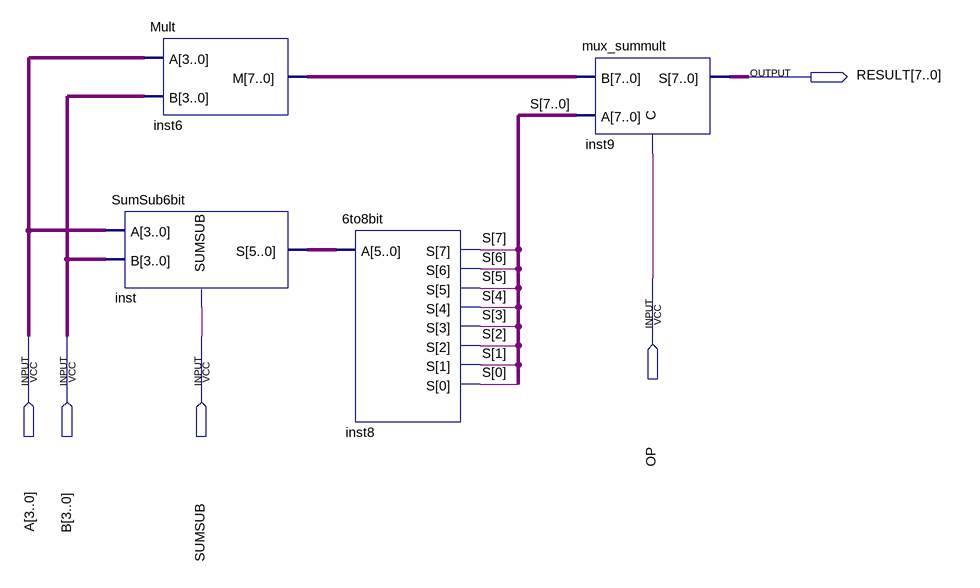
[diagram p0: schematic sheet]
// Quartus schematic ula_full.bdf as structural Verilog: 4 symbols, 5 pins
module ula_full (
  input  OP,
  input  [3:0] A,
  input  [3:0] B,
  input  SUMSUB,
  output [7:0] RESULT
);

  wire [5:0] inst_s;
  wire [7:0] inst6_m, S;

  Mult inst6 (.B(B), .A(A), .M(inst6_m));
  SumSub6bit inst (.B(B), .A(A), .PLUSMINUS(SUMSUB), .S(inst_s));
  \6to8bit  inst8 (.A(inst_s), .S(S));
  mux_summult inst9 (.A(S), .B(inst6_m), .C(OP), .S(RESULT));
endmodule
